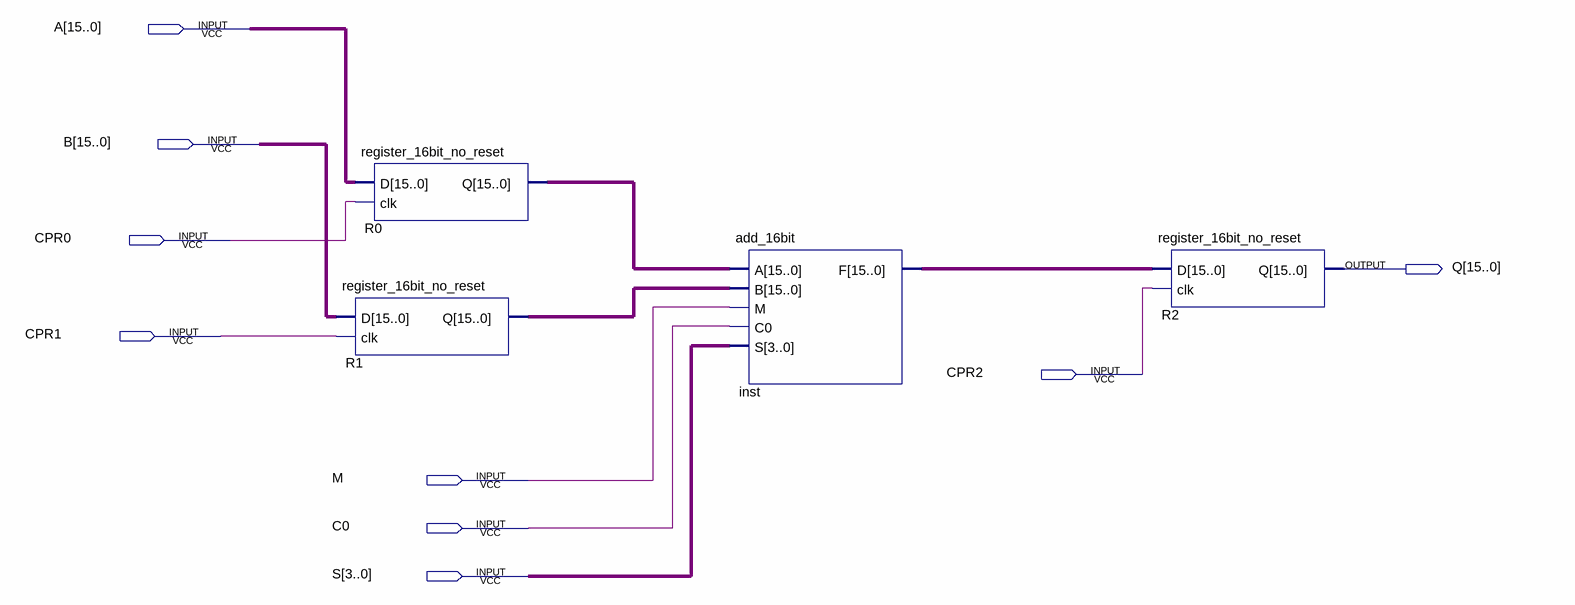
[diagram p0: schematic sheet]
// Quartus schematic ALU.bdf as structural Verilog: 4 symbols, 9 pins
module ALU (
  input  [15:0] A,
  input  [15:0] B,
  input  CPR0,
  input  CPR1,
  input  CPR2,
  input  M,
  input  C0,
  input  [3:0] S,
  output [15:0] Q
);

  wire [15:0] inst_f, R0_q, R1_q;

  register_16bit_no_reset R0 (.D(A), .clk(CPR0), .Q(R0_q));
  register_16bit_no_reset R1 (.D(B), .clk(CPR1), .Q(R1_q));
  add_16bit inst (.A(R0_q), .B(R1_q), .M(M), .C0(C0), .S(S), .F(inst_f));
  register_16bit_no_reset R2 (.D(inst_f), .clk(CPR2), .Q(Q));
endmodule
